# EAGLE design MotorControllerVersion2 (EAGLE 8.6.0)
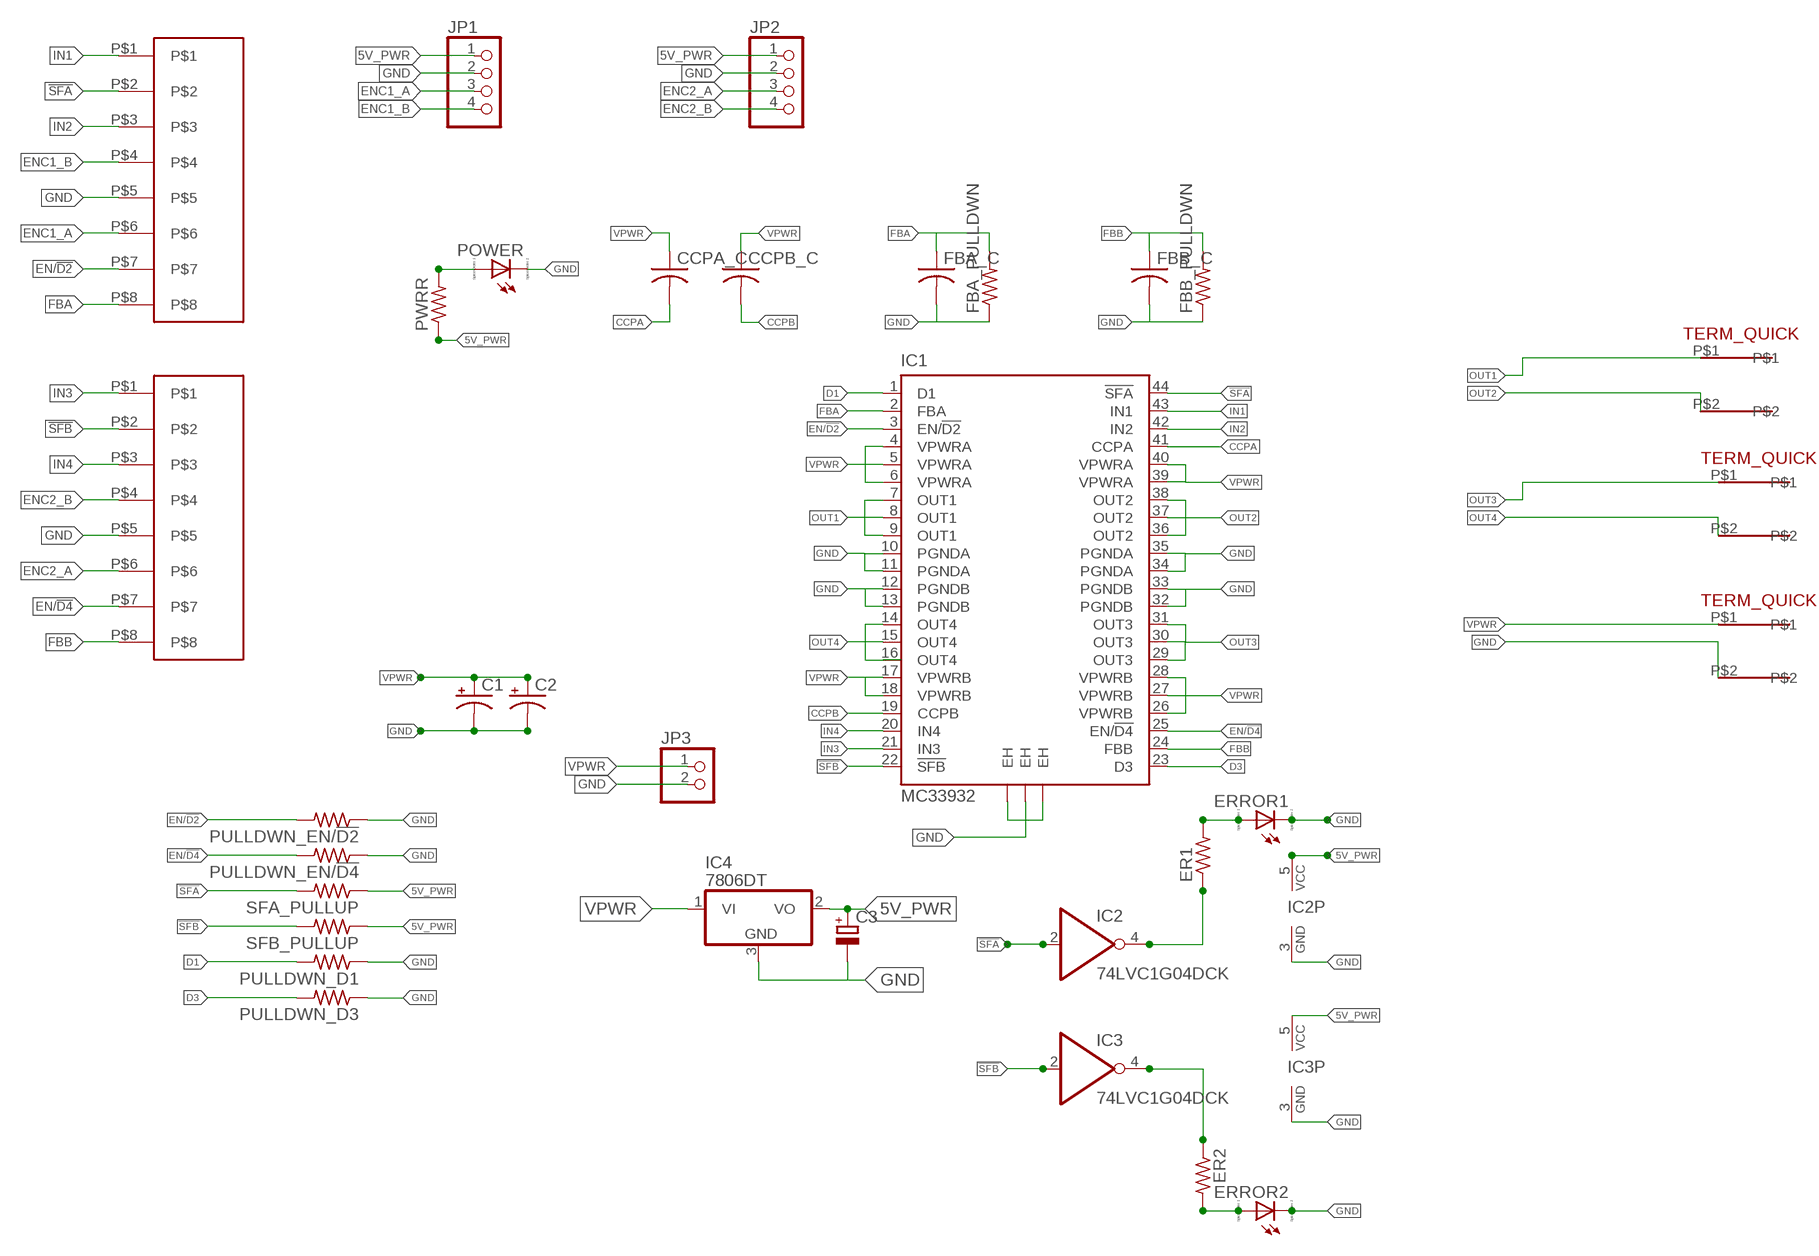
[diagram p0: schematic, sheet 1]

## Parts
C1  CPOL-US153CLV-0810  [153CLV-0810]
C2  CPOL-US153CLV-0810  [153CLV-0810]
C3  CPOL-EU153CLV-0405  [153CLV-0405]
CCPA_C  C-USC0805  [C0805]
CCPB_C  C-USC0805  [C0805]
ER1  R-US_R0805  [R0805]
ER2  R-US_R0805  [R0805]
ERROR1  LED_E  [LED_1206]
ERROR2  LED_E  [LED_1206]
FBA_C  C-USC0805  [C0805]
FBA_PULLDWN  R-US_R0805  [R0805]
FBB_C  C-USC0805  [C0805]
FBB_PULLDWN  R-US_R0805  [R0805]
IC1  MC33932  [HSOP44]
IC2  74LVC1G04DCK  [SC70-5]
IC3  74LVC1G04DCK  [SC70-5]
IC4  7806DT  [TO252]
JP1  PINHD-1X4  [1X04]
JP2  PINHD-1X4  [1X04]
JP3  PINHD-1X2  [1X02]
POWER  LED_E  [LED_1206]
PULLDWN_D1  R-US_R0805  [R0805]
PULLDWN_D3  R-US_R0805  [R0805]
PULLDWN_EN/!D2  R-US_R0805  [R0805]
PULLDWN_EN/!D4  R-US_R0805  [R0805]
PWRR  R-US_R0805  [R0805]
SFA_PULLUP  R-US_R0805  [R0805]
SFB_PULLUP  R-US_R0805  [R0805]
U$1  ETHERNETPORT  [ETHERNETPORT]
U$2  ETHERNETPORT  [ETHERNETPORT]
U$3  TERM_QUICK  [TERM_QUICK]
U$4  TERM_QUICK  [TERM_QUICK]
U$5  TERM_QUICK  [TERM_QUICK]

## Nets
5V_PWR: C3.+ IC2.5(VCC) IC3.5(VCC) IC4.2(VO) JP1.1 JP2.1 PWRR.1 SFA_PULLUP.1 SFB_PULLUP.1
!SFA: IC1.44(!SFA) IC2.2(I) SFA_PULLUP.2 U$1.P$2
!SFB: IC1.22(!SFB) IC3.2(I) SFB_PULLUP.2 U$2.P$2
CCPA: CCPA_C.2 IC1.41(CCPA)
CCPB: CCPB_C.2 IC1.19(CCPB)
D1: IC1.1(D1) PULLDWN_D1.2
D3: IC1.23(D3) PULLDWN_D3.2
EN/!D2: IC1.3(EN/!D2) PULLDWN_EN/!D2.2 U$1.P$7
EN/!D4: IC1.25(EN/!D4) PULLDWN_EN/!D4.2 U$2.P$7
ENC1_A: JP1.3 U$1.P$6
ENC1_B: JP1.4 U$1.P$4
ENC2_A: JP2.3 U$2.P$6
ENC2_B: JP2.4 U$2.P$4
FBA: FBA_C.1 FBA_PULLDWN.2 IC1.2(FBA) U$1.P$8
FBB: FBB_C.1 FBB_PULLDWN.2 IC1.24(FBB) U$2.P$8
GND: C1.- C2.- C3.- ERROR1.C ERROR2.C FBA_C.2 FBA_PULLDWN.1 FBB_C.2 FBB_PULLDWN.1 IC1.10(PGNDA) IC1.11(PGNDA) IC1.12(PGNDB) IC1.13(PGNDB) IC1.32(PGNDB) IC1.33(PGNDB) IC1.34(PGNDA) IC1.35(PGNDA) IC1.EH@1(EH) IC1.EH@2(EH) IC1.EH@3(EH) IC2.3(GND) IC3.3(GND) IC4.3(GND) JP1.2 JP2.2 JP3.2 POWER.C PULLDWN_D1.1 PULLDWN_D3.1 PULLDWN_EN/!D2.1 PULLDWN_EN/!D4.1 U$1.P$5 U$2.P$5 U$5.P$2
IN1: IC1.43(IN1) U$1.P$1
IN2: IC1.42(IN2) U$1.P$3
IN3: IC1.21(IN3) U$2.P$1
IN4: IC1.20(IN4) U$2.P$3
N$1: ER2.1 IC3.4(O)
N$3: POWER.A PWRR.2
N$7: ER1.1 IC2.4(O)
N$15: ER1.2 ERROR1.A
N$16: ER2.2 ERROR2.A
OUT1: IC1.7(OUT1) IC1.8(OUT1) IC1.9(OUT1) U$3.P$1
OUT2: IC1.36(OUT2) IC1.37(OUT2) IC1.38(OUT2) U$3.P$2
OUT3: IC1.29(OUT3) IC1.30(OUT3) IC1.31(OUT3) U$4.P$1
OUT4: IC1.14(OUT4) IC1.15(OUT4) IC1.16(OUT4) U$4.P$2
VPWR: C1.+ C2.+ CCPA_C.1 CCPB_C.1 IC1.4(VPWRA) IC1.5(VPWRA) IC1.6(VPWRA) IC1.17(VPWRB) IC1.18(VPWRB) IC1.26(VPWRB) IC1.27(VPWRB) IC1.28(VPWRB) IC1.39(VPWRA) IC1.40(VPWRA) IC4.1(VI) JP3.1 U$5.P$1

## Library data of the parts
C1 C2 = rcl:CPOL-US: POLARIZED CAPACITOR, American symbol; SPICEPREFIX: C
C3 = rcl:CPOL-EU: POLARIZED CAPACITOR, European symbol; SPICEPREFIX: C
CCPA_C CCPB_C FBA_C FBB_C = resistor:C-US: CAPACITOR, American symbol
ER1 ER2 FBA_PULLDWN FBB_PULLDWN PULLDWN_D1 PULLDWN_D3 PULLDWN_EN/!D2 PULLDWN_EN/!D4 PWRR SFA_PULLUP SFB_PULLUP = rcl:R-US_: RESISTOR, American symbol; SPICEPREFIX: R
ERROR1 ERROR2 POWER = eagle-ltspice:LED_E: LED Source: http://www.osram.convergy.de Source: www.luxeon.com Source: www.kingbright.com; SPICEMODEL: NONE; SPICEPREFIX: D; SPICETYPE: diode
IC1 = freescale:MC33932: 5.0 A Throttle Control H-Bridge Auto generated by make-symbol-device-package-bsdl.ulp Rev. 33 Source: http://www.freescale.com/files/analog/doc/data_sheet/MC33932.pdf?fpsp=1; MPN: MC33932VW; OC_FARNELL: 1701639; OC_NEWARK: 67P3304
IC2 IC3 = 74xx-little-de:74*1G04: INVERTER Gate
IC4 = linear:78*: Positive VOLTAGE REGULATOR Source: http://cache.national.com/ds/LM/LM78L05.pdf http://www.fairchildsemi.com/ds/LM/LM7805.pdf
JP1 JP2 = pinhead:PINHD-1X4: PIN HEADER
JP3 = pinhead:PINHD-1X2: PIN HEADER
U$1 U$2 = ETHERNETPORT:ETHERNETPORT: Digikey Part Number 380-1046-ND
U$3-U$5 = TERM_QUICK:TERM_QUICK

## Net classes
0 default: width 0.178 mm, drill 0.178 mm, clearance 0.178 mm

## Board
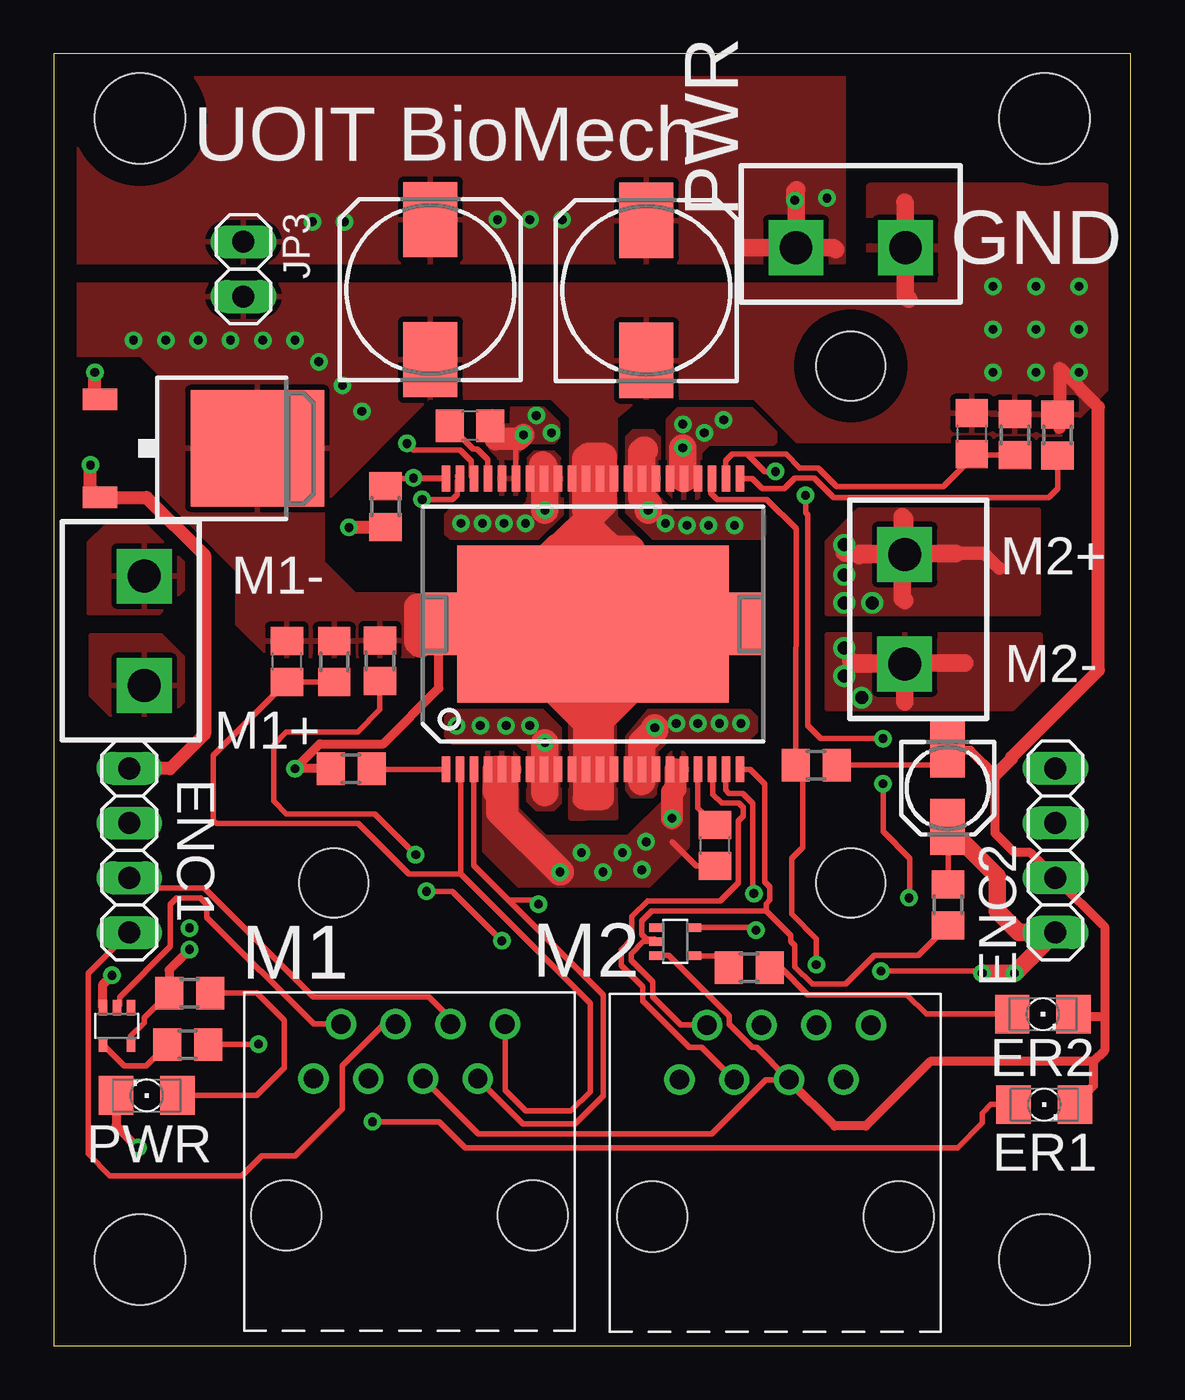
[diagram p1: board, top side]
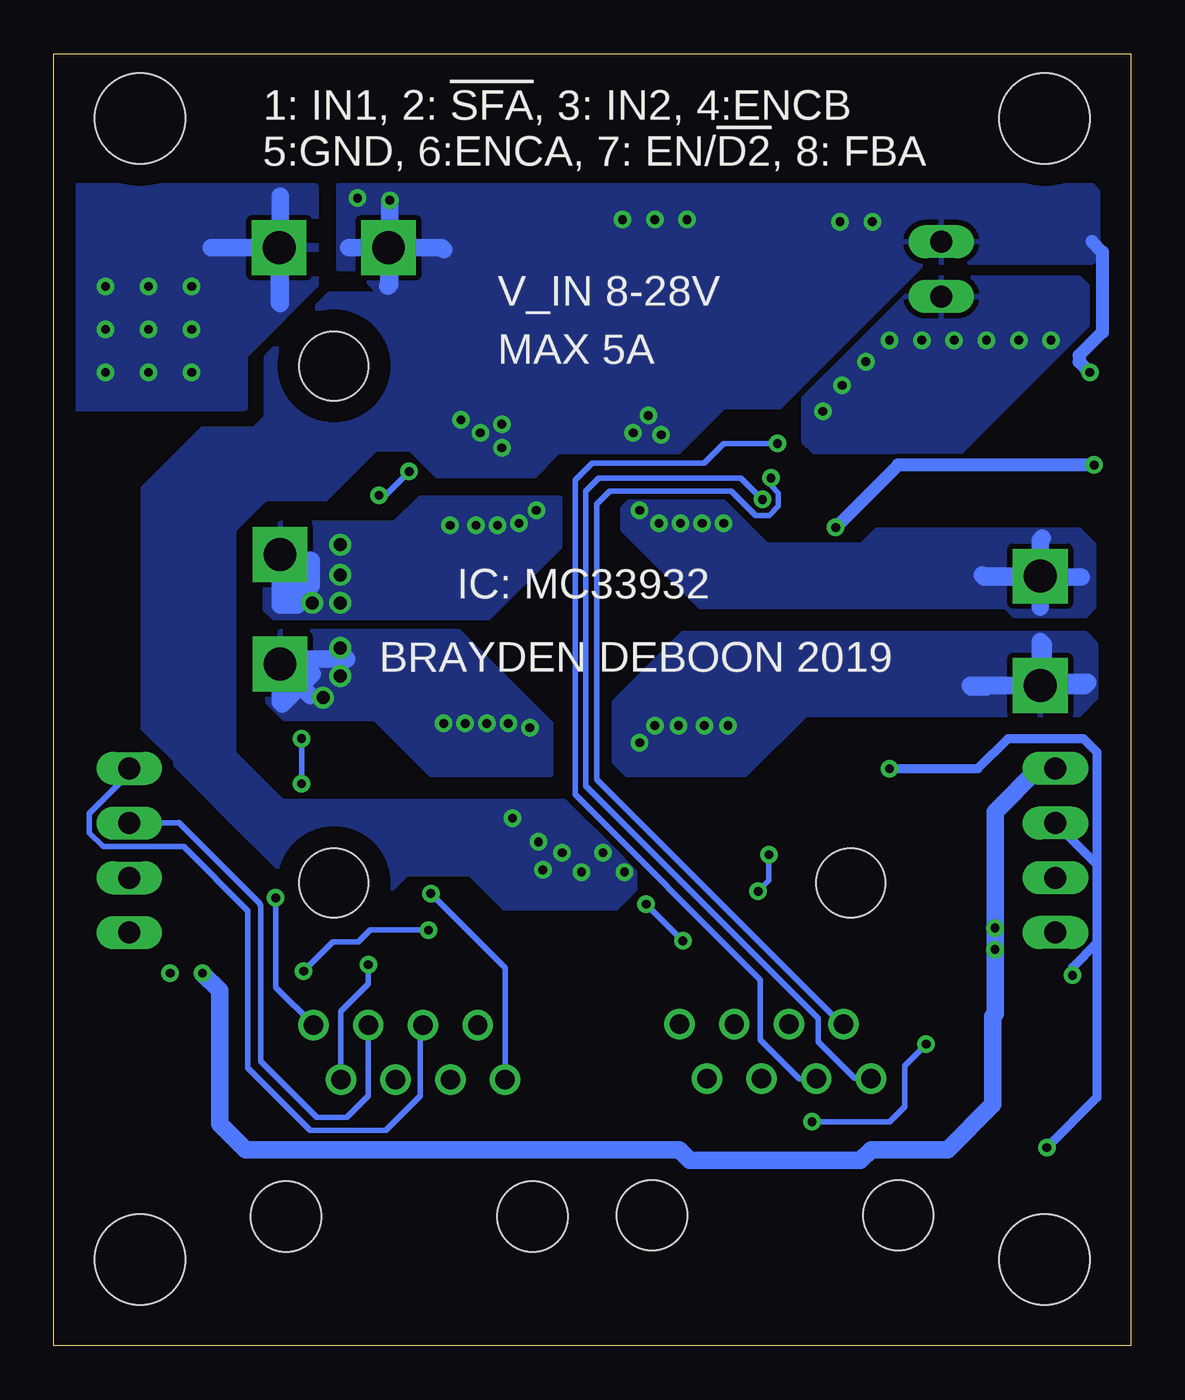
[diagram p2: board, bottom side, seen from below]

Size 50 x 60 mm. Coordinates in mm from the lower left corner, seen from the top.
Outline: 0,0 50,0 50,60 0,60 0,0
Copper layers (1*16): Top 0.035mm / dielectric 1.5mm / Bottom 0.035mm
Design rules "default *": minimum track width 6mil, minimum drill 0.35mm, track to track 8mil, track to pad 8mil, pad to pad 8mil, via to via 8mil, smd to smd 0mil, copper to edge 40mil, drill to drill 6mil, minimum pad ring 10mil, minimum via ring 8mil, stop-mask expansion 4mil, vias tented up to drill 0mil, thermal gap 10mil
Holes 3.2 mm at 13,21.5 37,21.5 37,45.5
Holes 4.2 mm at 4,4 46,4 4,57 46,57

### Footprints (pad centres in the part's own frame; a part is rotated, then mirrored left to right if it is on the bottom)
153CLV-0810 = smd 3.5 x 2.5: + 3.25,0; - -3.25,0
153CLV-0405 = smd 2.6 x 1.6: + 1.8,0; - -1.8,0
C0805 = smd 1.3 x 1.5: 1 -0.95,0; 2 0.95,0
R0805 = smd 1.3 x 1.5: 1 -0.95,0; 2 0.95,0
LED_1206 = smd 1.6 x 1.803: A -1.422,0; C 1.422,0
HSOP44 = smd 0.4 x 1.2: 1 -6.825,-6.75; 2 -6.175,-6.75; 3 -5.525,-6.75; 4 -4.875,-6.75; 5 -4.225,-6.75; 6 -3.575,-6.75; 7 -2.925,-6.75; 8 -2.275,-6.75; 9 -1.625,-6.75; 10 -0.975,-6.75; 11 -0.325,-6.75; 12 0.325,-6.75; 13 0.975,-6.75; 14 1.625,-6.75; 15 2.275,-6.75; 16 2.925,-6.75; 17 3.575,-6.75; 18 4.225,-6.75; 19 4.875,-6.75; 20 5.525,-6.75; 21 6.175,-6.75; 22 6.825,-6.75; 23 6.825,6.75; 24 6.175,6.75; 25 5.525,6.75; 26 4.875,6.75; 27 4.225,6.75; 28 3.575,6.75; 29 2.925,6.75; 30 2.275,6.75; 31 1.625,6.75; 32 0.975,6.75; 33 0.325,6.75; 34 -0.325,6.75; 35 -0.975,6.75; 36 -1.625,6.75; 37 -2.275,6.75; 38 -2.925,6.75; 39 -3.575,6.75; 40 -4.225,6.75; 41 -4.875,6.75; 42 -5.525,6.75; 43 -6.175,6.75; 44 -6.825,6.75 | smd 12.6 x 7.3: EH@1 0,0 | smd 1.7 x 2.9: EH@2 -7.15,0; EH@3 7.15,0
SC70-5 = smd 0.4 x 0.7: 1 -0.65,-0.85; 2 0,-0.85; 3 0.65,-0.85; 4 0.65,0.85; 5 -0.65,0.85
TO252 = smd 1 x 1.6: 1 -2.28,-4.8; 2 2.28,-4.8 | smd 5.4 x 6.2: 3 0,2.5
1X04 = drill 1.016 long: 1 -3.81,0; 2 -1.27,0; 3 1.27,0; 4 3.81,0
1X02 = drill 1.016 long: 1 -1.27,0; 2 1.27,0
ETHERNETPORT = drill 0.9: P$1 -4.45,6.36; P$2 -3.18,8.89; P$3 -1.91,6.35; P$4 -0.64,8.89; P$5 0.63,6.35; P$6 1.9,8.89; P$7 3.17,6.35; P$8 4.44,8.89 | hole 3.25: 5.72,0; -5.72,0
TERM_QUICK = drill 1.524 pad 2.54 square: P$1 2.54,0; P$2 -2.54,0

### Placement (x,y rotation side)
C1  27.51,49.01 90 top
C2  17.48,49.05 90 top
C3  41.5,25.9 270 top
CCPA_C  19.32,42.72 180 top
CCPB_C  30.7,23.23 90 top
ER1  6.21,13.98 0 top
ER2  32.29,17.56 0 top
ERROR1  45.98,11.2 0 top
ERROR2  45.92,15.4 0 top
FBA_C  10.82,31.78 90 top
FBA_PULLDWN  13.02,31.77 270 top
FBB_C  42.62,42.36 90 top
FBB_PULLDWN  44.62,42.31 270 top
IC1  25.03,33.52 0 top
IC2  2.93,14.85 180 top
IC3  28.85,18.77 270 top
IC4  6.95,41.68 270 top
JP1  3.5,23 270 top
JP2  46.5,23 90 top
JP3  8.8,50 270 top
POWER  4.31,11.62 180 top
PULLDWN_D1  13.8,26.8 0 top
PULLDWN_D3  46.6,42.3 270 top
PULLDWN_EN/!D2  15.14,31.81 270 top
PULLDWN_EN/!D4  35.39,26.96 180 top
PWRR  6.3,16.38 0 top
SFA_PULLUP  15.4,38.97 90 top
SFB_PULLUP  41.52,20.48 270 top
U$1  16.51,6.05 0 top
U$2  33.5,6 0 top
U$3  4.2,33.2 270 top
U$4  39.5,34.2 90 top
U$5  37,51 180 top

### Tracks (layer width: path | path; a pad name or v marks a point on that pad's centre or on a via)
5V_PWR  (via drill 0.41)
  Top 0.254: SFB_PULLUP.1 41.52,24.08 C3.+ | PWRR.1 4.2,15.23 4.2,15 3.58,14.38 IC2.5 | IC3.5 32.48,19.42 v32.6,19.3 | v38.4,17.4 43,17.4 v43.1,17.3
  Top 0.406: v6.3,18.4 5.35,17.45 PWRR.1
  Top 0.61: JP1.1 5.4,26.8 7,28.4 7,36.7 4.3,39.4 IC4.2 1.7,39.85 v1.7,40.9 | v13.7,38 13.72,38.02 SFA_PULLUP.1
  Top 0.813: C3.+ 43.8,21.8 43.8,20.2 44.81,19.19 JP2.1 v44.61,17.3 v44.6,17.3 v43.1,17.3
  Bottom 0.254: v32.6,19.3 35.32,19.3 35.86,18.76 37.04,18.76 v38.4,17.4
  Bottom 0.61: v1.7,40.9 10.8,40.9 v13.7,38
  Bottom 0.813: v43.1,17.3 42.3,16.5 42.3,10.3 41.1,9.1 20.97,9.1 20.47,8.6 12.55,8.6 12.05,9.1 8.5,9.1 6.4,11.2 6.4,15.3 6.3,15.4 v6.3,18.4 v6.3,19.4 6.3,24.8 4.29,26.81 JP1.1
!SFA  (via drill 0.41)
  Top 0.254: SFA_PULLUP.2 15.75,40.27 IC1.44 18.18,40.3 v16.7,40.3 | IC2.2 3.05,15.82 3.05,16.19 5.4,18.54 5.4,20.5 5.7,20.8 6.8,20.8 7.1,20.5 7.1,19.9 12.06,14.94 U$1.P$2
  Bottom 0.254: v16.7,40.3 16.7,39.94 16.36,39.6 16.36,38.99 16.8,38.56 17.41,38.56 18.54,39.7 24.2,39.7 24.8,39.1 24.8,26.3 13.44,14.94 U$1.P$2
!SFB
  Top 0.254: IC1.22 32.33,26.77 33,26.1 33,21.54 33.24,21.3 33.24,20.7 33.07,20.52 33.07,20.2 | 33.07,20.2 34.22,19.05 34.22,18.78 34.4,18.6 34.4,17.6 35.2,16.8 36.76,16.8 38.09,18.14 40.13,18.14 SFB_PULLUP.2 | 33.07,20.2 27.76,20.2 27.3,19.74 27.3,19.1 27.51,18.89 27.88,18.89 IC3.2 27.37,18.77 26.8,18.2 26.8,17.9 27.8,16.9 27.8,16.2 29.11,14.89 U$2.P$2
CCPA
  Top 0.254: IC1.41 20.16,41.15 19.66,41.64 19.48,41.64 18.4,42.72 CCPA_C.2
CCPB
  Top 0.254: CCPB_C.2 29.91,24.98 IC1.19
D1
  Top 0.254: IC1.1 14.78,26.77 PULLDWN_D1.2
D3
  Top 0.254: IC1.23 32.43,40.27 32.9,39.8 33.9,39.8 34.4,40.3 35.3,40.3 36.2,39.4 46.2,39.4 46.6,39.8 PULLDWN_D3.2
EN/!D2  (via drill 0.41)
  Top 0.254: IC1.3 19.5,22.3 21.1,20.7 | 21.1,20.7 25.5,16.3 25.5,11.6 24.2,10.3 21.78,10.3 U$1.P$7 | 21.1,20.7 22.3,20.7 v22.5,20.5 22.6,20.4 | PULLDWN_EN/!D2.2 15.14,29.54 14.1,28.5 10.8,28.5 10.2,27.9 10.2,25.3 10.8,24.7 14.33,24.7 | 14.33,24.7 | 14.33,24.7 14.9,24.7 v16.8,22.8 | v20.8,18.8 18.5,21.1 v17.3,21.1
  Bottom 0.254: v22.5,20.5 v20.8,18.8 20.7,18.7 | v16.8,22.8 16.8,21.6 v17.3,21.1
EN/!D4  (via drill 0.41)
  Top 0.254: IC1.25 30.55,39.66 30.5,39.6 30.8,39.3 33.1,39.3 34.46,37.94 PULLDWN_EN/!D4.2 34.76,26.64 34.76,23.14 34.26,22.64 34.26,20.04 35.4,18.9 v35.4,17.7
  Bottom 0.254: U$2.P$7 36.67,15.53 35.4,16.8 v35.4,17.7
ENC1_A
  Top 0.254: JP1.3 3.97,21.26 6.99,21.26 12.05,16.2 17.4,16.2 18.41,15.19 U$1.P$6
ENC1_B
  Top 0.254: JP1.4 1.6,17.29 1.6,8.9 2.6,7.9 8.72,7.9 9.64,8.82 11.22,8.82 12.3,9.9 12.4,10 13.4,11 13.4,13 15.34,14.94 U$1.P$4
ENC2_A
  Bottom 0.254: U$2.P$6 35.4,11.6 36.4,10.6 37.8,10.6 40.4,13.2 40.4,20.46 40.44,20.5 40.44,20.54 41.35,21.45 44.2,24.3 44.23,24.27 JP2.3
ENC2_B
  Bottom 0.254: JP2.4 46.5,26.58 48.35,24.72 48.35,23.82 47.71,23.18 43.98,23.18 41,20.2 41,12.9 38.1,10 34.6,10 33,11.6 33,14.75 U$2.P$4
FBA
  Top 0.254: U$1.P$8 20.95,11.85 21.9,10.9 24,10.9 24.9,11.8 24.9,15.9 18.9,21.9 | IC1.2 18.9,26.73 18.9,21.9 | FBA_PULLDWN.2 FBA_C.1 7.4,27.41 7.4,24.4 7.56,24.24 14.14,24.24 16.48,21.9 18.9,21.9
FBB  (via drill 0.41)
  Top 0.254: IC1.24 31.2,41.09 31.2,41.1 31.5,41.4 32.2,41.4 | 32.2,41.4 34,41.4 34.64,40.76 35.49,40.76 36.35,39.9 41.3,39.9 42.62,41.22 FBB_C.1 42.67,41.36 FBB_PULLDWN.2 | 32.2,41.4 33,40.6 v33.5,40.6 | v34.9,39.5 34.9,38.7 35,38.6 35,28.8 35.6,28.2 v38.5,28.2 38.6,28.2 | v38.5,26.1 38.5,23.88 39.74,22.64 39.74,20.8 v39.7,20.8
  Bottom 0.254: v33.5,40.6 34.6,39.5 v34.9,39.5 | v38.5,28.2 v38.5,26.1 | U$2.P$8 39.7,16.65 v39.7,20.8
GND  (via drill 0.41)
  Top 0.254: PULLDWN_EN/!D4.1 40.76,26.96 41.45,27.65 | 41.45,27.65 C3.- | 41.7,27.65 41.45,27.65 | IC3.3 28.55,18.12 31.35,15.32 31.35,14.93 32.43,13.86 32.62,13.86 U$2.P$5 34.1,12.35 33.05,12.35 30.55,9.84 19.7,9.84 U$1.P$5
  Top 0.406: 48.28,13.2 48.78,13.7 48.78,15.3 | 48.28,13.2 40.7,13.2 37.7,10.2 36.25,10.2 34.1,12.35 | 48.78,15.3 48.78,19.45 JP2.2 45.33,22.9 44.6,22.9 43.7,23.8 43.7,26.5 42.55,27.65 41.7,27.65 | POWER.C 2.89,10.21 v3.9,9.2 | IC2.3 2.28,16.78 v2.7,17.2 | PULLDWN_D1.1 v11.2,26.8 12.36,27.96 15.3,27.96 17.88,30.54 IC1.EH@2 | ERROR1.C 48.28,12.08 48.28,13.2 | ERROR2.C 47.44,15.3 48.78,15.3
  Top 0.61: 43.7,26.5 44.47,27.27 44.47,27.34 48.5,31.37 48.5,43.6 46.7,45.4 46.7,42.65 PULLDWN_D3.1 | IC1.EH@1 IC1.EH@3
  Top 0.813: 39.7,48.6 39.54,48.76 U$5.P$2 39.54,53.06 39.5,53.1
  Top 1.016: IC1.EH@1 25.03,29.07 25.3,28.8 27.3,30.8 27.3,30.9 26.8,30.9 25.5,29.6 24.4,29.6 23.2,30.8 23.2,30.3 24.6,28.9 24.6,25.4 25.5,25.4 25.5,28.9 25.4,29
  Top 1.27: IC1.EH@1 25.03,37.73 25.1,37.8 25.9,37 | 25.9,37 26.8,37 | 25.9,37 23.6,37 23.5,37.1 23.3,36.9 23.2,36.9 | 23.2,36.9 23.4,37.1 | 23.2,36.9 23.1,36.8 23.1,36.7 25.5,39.1 25.5,41.3 24.8,41.3 24.7,41.2 24.7,38.8 25.36,39.45 IC1.33 | IC1.EH@2 17.1,34.3 16.9,34.3 16.9,32.7 17,32.6 17.88,33.48 IC1.EH@2
  Bottom 0.406: v2.7,17.2 2.7,17.58 1.57,18.71 | JP1.2 1.57,22.34 | 1.57,22.34 1.57,18.71 | 1.57,18.71 1.57,11.53 v3.9,9.2 | v11.2,26.8 7.1,26.8 5.7,28.2 2.2,28.2 1.57,27.57 1.57,22.34
  Bottom 0.813: U$5.P$2 39.54,48.44 39.5,48.4 39.5,51.04 | 39.5,53.4 39.5,51.04 | 39.5,51.04 U$5.P$2 | 42.7,51 U$5.P$2
  other vias: 43.6,49.2 45.6,49.2 43.6,47.2 47.6,49.2 47.6,45.2 45.6,45.2 47.6,47.2 45.6,47.2 3.7,46.7 5.2,46.7 6.7,46.7 8.2,46.7 9.7,46.7 11.2,46.7 12.3,45.7 13.4,44.6 14.3,43.4 43.6,45.2
  pour Top: 0.5,49.3 49.5,49.3 49.5,45 46.5,42 34.5,42 32.5,44 17.4,44 12.5,39.1 12.5,36.4 14,34.9 17.5,34.9 17.5,32 10,32 8.5,33.5 8.5,36 5,39.5 5,45 4,46 0.5,46
  pour Top: 23.1,44 24,43.1 24,38.4 22.6,37.1 27.5,37.1 26.1,38.5 26.1,43.1 27.3,44.1
  pour Top: 24.6,24.5 24.6,30.7 26,30.7 26.1,24.5
  pour Bottom: 3.5,49.6 9.6,49.6 13,46.2 15.2,44 15.2,42 14.7,41.5 7.9,41.5 2,47.4 2,49.2 2.4,49.6
  pour Bottom: 42.7,49.7 48.4,49.7 49,49.1 48.9,43.5 42.6,43.5
  pour Top: 24.6,29.5 24,29.5 24,24.5 24.7,24.5 24.7,29.4
  pour Bottom: 37.9,53.8 37.9,49.3 41.2,46 41.2,43.6 49.7,43.6 49.9,53.8
  pour Top: 48.8,49.5 48.8,53.8 37.9,53.8 37.9,49.5
IN1  (via drill 0.41)
  Top 0.254: 18.73,40.39 IC1.43 18.73,40.15 18.73,39.53 18.5,39.3 v17.1,39.3 17,39.3
  Bottom 0.254: v17.1,39.3 18.1,40.3 24.7,40.3 25.3,39.7 25.3,26 14.5,15.2 14.5,14.1 12.81,12.41 U$1.P$1
IN2  (via drill 0.41)
  Top 0.254: IC1.42 19.39,40.39 19.39,41.09 18.88,41.6 16.7,41.6 v16.4,41.9
  Bottom 0.254: v16.4,41.9 18.9,41.9 19.8,41 25,41 25.8,40.2 25.8,25.6 17.2,17 17.2,14.2 15.4,12.4 U$1.P$3
IN3  (via drill 0.41)
  Top 0.254: IC1.21 31.2,25.8 31.34,25.66 31.99,25.66 32.46,25.19 32.46,21.04 v32.5,21
  Bottom 0.254: v32.5,21 29.05,17.55 U$2.P$1
IN4
  Top 0.254: IC1.20 30.6,26.73 30.6,25.6 31,25.2 31.8,25.2 32,25 32,24.6 31.78,24.38 31.78,21.49 30.94,20.66 27.57,20.66 26.84,19.93 26.84,18.89 26.34,18.39 26.34,17.66 27.34,16.66 27.34,16.01 29.5,13.86 30.08,13.86 U$2.P$3
N$1
  Top 0.254: 29.74,18.16 IC3.4 29.72,18.1 30.9,18.1 31.34,17.66 ER2.1
N$3
  Top 0.254: POWER.A 9.42,11.62 10.7,12.9 10.7,15.1 9.42,16.38 PWRR.2
N$7
  Top 0.254: IC2.4 3.28,13 4.3,13 5.26,13.96 ER1.1
N$15  (via drill 0.41)
  Top 0.254: ER1.2 7.18,14 v9.5,14 | ERROR1.A 43.5,11.2 43.1,10.8 43.1,10.34 41.96,9.2 19.1,9.2 17.9,10.4 v14.8,10.4
  Bottom 0.254: v9.5,14 10.5,13 10.5,11.1 11.2,10.4 v14.8,10.4
N$16
  Top 0.254: ERROR2.A 40.5,15.4 39.6,16.3 35,16.3 33.74,17.56 ER2.2 33.24,18.06
OUT1  (via drill 0.41)
  Top 1.27: v22.8,28 22.8,25.7
  Bottom 0.813: U$3.P$1 2.14,30.66 2,30.8 4.06,30.8 4.06,32.56 4.2,32.7 U$3.P$1 | U$3.P$1 6.64,30.66 6.7,30.6 7.4,30.6 7.46,30.66 U$3.P$1
  other vias: 22.1,28.8 21,28.8 19.8,28.8 18.7,28.8
  pour Top: 23.5,25.8 23.5,28.7 22.7,29.5 18.5,29.5 18.2,29.2 18.2,28.3 18.5,28 21.5,28 22,27.5 22,25.6 22,25.3 22.4,24.9 23.2,24.9 23.5,25.2
  pour Top: 1.7,33 5,33 6,32 6,29.9 5.4,29.3 2.6,29.3 1.7,30.2
  pour Bottom: 24,29.9 24,27.1 23.4,26.5 17.9,26.5 15.1,29.3 2.4,29.3 1.6,30.1 1.6,30.2 1.6,32.6 2.1,33.1 20.8,33.1
OUT2  (via drill 0.41)
  Top 1.27: v22.8,38.8 22.8,40.23 IC1.37 22.75,40.84 22.7,40.9
  Bottom 0.813: U$3.P$2 6.84,35.74 | 6.84,35.74 6.9,35.8 | 6.84,35.74 6.8,35.7 4.16,35.7 | 2.3,35.7 4.16,35.7 | 4.16,35.7 U$3.P$2 | 4.1,37.5 4.2,37.4 U$3.P$2 | 4.2,34.3 U$3.P$2
  other vias: 18.9,38.2 19.9,38.2 20.9,38.2 21.9,38.2
  pour Top: 23.6,40.8 23.6,41.1 23.2,41.5 22.3,41.5 22,41.2 22,39.2 21.3,38.5 21.3,37.7 21.5,37.5 22.5,37.5 23.6,38.6
  pour Top: 21.8,38.9 18.5,38.9 18.2,38.6 18.2,37.7 18.4,37.5 21.8,37.5
  pour Top: 1.6,34 4.9,34 6,35.1 6,36.4 4.3,38.1 2.4,38.1 1.6,37.3
  pour Bottom: 23.3,39.2 23.6,38.9 23.6,37.9 20,34.3 5.8,34.3 5.4,33.9 2.1,33.9 1.7,34.3 1.7,37.2 2.4,37.9 11.8,37.9 12.5,37.2 16.9,37.2 18.9,39.2
OUT3  (via drill 0.41, 0.6)
  Top 0.61: 37.4,36.7 36.7,36.7 36.6,36.8 37.4,36.8 39.44,36.8 | 43.9,36.1 43.2,36.8 41.9,36.8 39.44,36.8 | 39.44,36.8 U$4.P$1
  Top 0.813: 37.4,36.7 37.44,36.74 U$4.P$1 39.5,38.4 39.4,38.5 39.4,34.7 39.5,34.6 | 37.4,36.8 41.9,36.8
  Top 1.27: v27.6,38.8 27.6,39.1 27.3,39.4 27.3,41.5 27.3,41.51 | 27.4,41.6 27.3,41.51 | 27.3,41.51 IC1.30
  Bottom 0.813: 38.7,34.4 39.5,34.4 U$4.P$1 38.06,35.3 38.06,36.46 38.1,36.5 38.7,35.9 38.7,34.4
  other vias: 28.4,38.2 29.4,38.1 30.4,38.1 31.6,38.1 38,34.5 36.7,34.5 36.7,35.8 36.7,37.2
  pour Top: 26.6,40.8 26.6,42.2 26.9,42.5 27.8,42.5 28,42.3 28.1,42.2 28.1,39.4 28.8,38.7 32.8,38.7 33,38.5 33,37.8 33,37.7 32.8,37.5 27.8,37.5 26.6,38.7
  pour Top: 35.9,34 45.7,34 45.7,38.8 37.4,38.8 35.9,37.3
  pour Bottom: 26.5,39.4 33,39.4 34.2,38.2 39.5,38.2 40.2,37.5 40.2,34.2 39.8,33.8 31.2,33.8 29.8,33.8 26.7,36.9 26.5,37.1
  pour Top: 42.3,34 45.7,34 45.7,35.9 42.2,35.9 42,35.7 42,34.3
OUT4  (via drill 0.41, 0.6)
  Top 0.813: U$4.P$2 37.14,31.66 37.1,31.7 | 37,31.8 37.1,31.7 | 37.1,31.7 39.54,31.7 | 42.3,31.7 39.54,31.7 | 39.5,29.9 U$4.P$2 | U$4.P$2 39.54,31.7
  Top 1.27: v27.9,28.7 27.9,28.6 27.3,28 27.3,26.2 IC1.15
  Bottom 0.813: 36.4,31.9 39.26,31.9 U$4.P$2 39.5,29.9 39.4,29.8 38,31.2 39.1,31.2 38.1,30.2
  other vias: 28.9,28.9 29.9,28.9 30.9,28.9 31.9,28.9 37.5,30.1 36.7,31.1 36.7,32.4
  pour Top: 26.6,28.3 26.6,25.8 26.8,25.5 27.8,25.5 28,25.7 28,27.6 28.5,28.1 32.2,28.1 32.6,28.5 32.6,29.2 32.3,29.5 27.6,29.5
  pour Top: 45.7,33 35.9,33 35.9,29.7 35.9,29.6 39.8,29.6 44.5,29.6 45.8,30.9 45.8,33
  pour Bottom: 26.9,26.5 32.5,26.5 35.1,29.1 39.3,29.1 40.1,29.9 40.1,32.6 39.5,33.2 31.2,33.2 27,29 26.9,28.9
VPWR  (via drill 0.41)
  Top 0.254: CCPB_C.1 29.82,22.28 28.7,23.4 | 20.54,26.77 IC1.5 IC1.6 21.45,24.05 v23.5,22 | IC1.39 21.45,41.95 v21.8,42.3
  Top 0.61: IC4.1 1.9,44.21 v1.9,45.2
  Top 0.813: U$5.P$1 34.46,53.66 | 34.46,53.66 34.5,53.7 | 34.46,53.66 34.4,53.6 v34.4,53.2 | 32,51 U$5.P$1 | 36.3,50.9 36.2,51 U$5.P$1
  Top 1.016: v28.7,24.5 28.7,25.71 28.87,25.88 28.87,26.77 | v21.8,42.3 21.6,42.1 20.5,42.1
  Top 1.27: v29.2,41.7 29.2,40.33 IC1.27 | IC1.5 20.8,25.59 20.9,25.5 | v23.5,22 20.7,24.8 20.7,25.6 20.54,25.76 20.54,26.77 21.07,26.77
  Bottom 0.61: 1.81,51.29 1.32,50.8 1.32,47.07 2.4,46 2.4,45.7 v1.9,45.2
  Bottom 0.813: U$5.P$1 34.46,49.24 | 34.46,49.24 34.5,49.2 | 34.46,49.24 34.4,49.3 34.4,51 | 34.4,51 v34.4,53.2 | 31.9,50.9 32,51 34.4,51 | 36.3,51 34.4,51
  other vias: 29.2,42.8 30.2,42.4 31.1,43 24.5,22.9 25.5,22 26.4,22.9 27.3,22.1 27.5,23.4 22.4,43.2 23.1,42.4 35.9,53.3 12,52.2 13.5,52.2 20.6,52.3 22.1,52.3 23.6,52.3
  pour Top: 0.5,50.3 36.7,50.3 36.7,59.5 0.5,59.5
  pour Top: 21.5,39.6 21.5,41.5 22,42 23.2,42 23.4,42.2 23.4,42.8 22.7,43.5 20.5,43.5 20.3,43.3 20.3,41.7 20.7,41.3 20.7,39.6
  pour Top: 28.5,39.7 28.8,39.4 29.9,39.4 30,39.5 30,41.5 30.4,41.9 33.4,41.9 33.5,42 33.5,42.4 32.4,43.5 29,43.5 28.5,43
  pour Top: 28.5,27.3 28.7,27.5 29.2,27.5 29.3,27.4 29.4,27.3 29.4,23.2 27.6,21.4 23.7,21.4 21.6,21.4 20,23 20,27.4 20.1,27.5 21.3,27.5 21.5,27.3 21.5,24.9 22.8,23.6 26.2,23.6 26.7,23.6 28.5,25.4
  pour Bottom: 24.2,23.2 26.3,25.3 37.6,25.3 39.4,25.3 40.8,26.7 40.9,26.7 42.5,25.1 39,21.6 39,20.6 38,19.6 36.2,19.6 35.9,19.6 33.9,21.6 33.6,21.9 30.7,21.9 29.1,20.3 23.9,20.3 23.3,20.9 23,21.2 23,22
  pour Bottom: 29.8,44.4 22.5,44.4 21.2,44.4 20.7,43.9 20.7,43.2 20.7,42 21.1,41.6 21.2,41.5 26.6,41.5 27.7,40.4 31.6,40.4 32.2,40.4 34.3,42.5 32.4,44.4
  pour Bottom: 9.8,50.1 16.3,43.6 18.9,43.6 21,41.5 21.1,41.5 27.5,41.5 36.1,50.1
  pour Bottom: 36.8,50 36.8,53.9 1.8,53.9 1.5,53.6 1.5,50.6 1.8,50.3 9.6,50.3 9.9,50
  pour Bottom: 40.8,26.6 41.7,27.5 41.7,33 41.7,37.9 40.9,38.7 40.2,39.4 37.4,39.4 35.1,41.7 30.8,41.7 30.8,46.8 32.8,48.8 37.2,48.8 40,46 40.1,45.9 40.1,43.7 40.1,43.1 40.7,42.5 43.1,42.5 45.8,39.8 45.8,35.5 45.8,28.7 44.3,27.2 44.3,27 42.3,25 40.8,26.5

### Text on the board
tPlace: PWR | UOIT BioMech | GND | M2+ | M1- | M2- | M1+ | ENC1 | ENC2 | M1 | M2 | ER2 | ER1 | PWR
bPlace: 1: IN1, 2: !SFA, 3: IN2, 4:ENCB / 5:GND, 6:ENCA, 7: EN/!D2, 8: FBA | V_IN 8-28V | MAX 5A | IC: MC33932 | BRAYDEN DEBOON 2019